# Altium schematic sheet STM32-PROX_3.SchDoc
size 225 x 183 mm
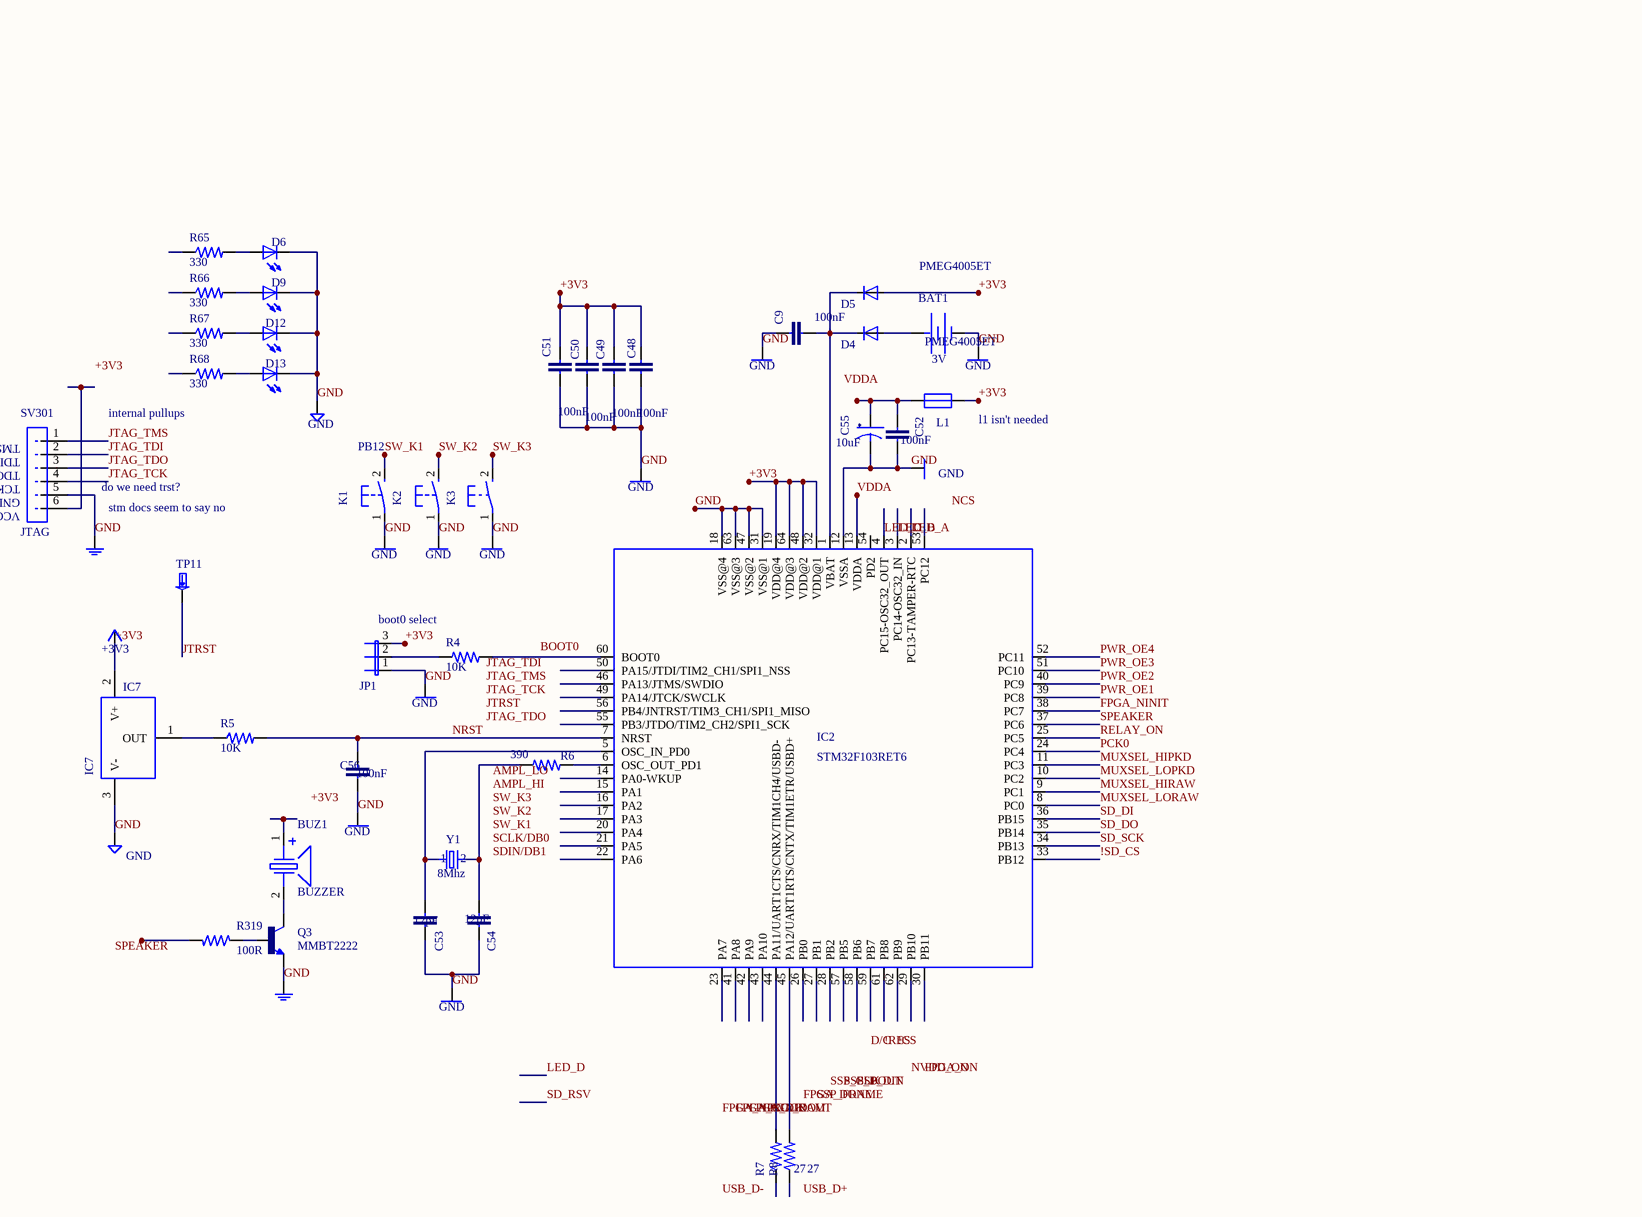
[diagram p0: STM32-PROX_3.SchDoc]

## Parts
BAT1  3V  [NSL_SPARKFUN_BATTCON_12MM]
BUZ1  BUZZER  [BUZZER]
C9  100nF  [0805]
C48  100nF  [0805]
C49  100nF  [0805]
C50  100nF  [0805]
C51  100nF  [0805]
C52  100nF  [0805]
C53  12pF  [0805]
C54  12pF  [0805]
C55  10uF  [EIA3216-KIT]
C56  100nF  [0805]
D4  PMEG4005ET  [SOT23-3]
D5  PMEG4005ET  [SOT23-3]
D6  (no value)  [LED_0603]
D9  (no value)  [LED_0603]
D12  (no value)  [LED_0603]
D13  (no value)  [LED_0603]
GND1  GND
GND2  GND
GND4  GND
GND5  GND
GND6  GND
GND7  GND
GND8  GND
GND43  GND
GND45  GND
GND46  GND
IC2  STM32F103RET6  [LQFP64_PACKAGE]
IC7  (no value)  [SOT23-3LEAD]
JP1  boot0 select  [JUMPER3]
K1  (no value)  [B3F-5XX]
K2  (no value)  [B3F-5XX]
K3  (no value)  [B3F-5XX]
L1  (no value)  [0603]
Q3  MMBT2222  [SOT-23-3]
R4  10K  [R0805]
R5  10K  [R0805]
R6  390  [R0805]
R7  27  [R0805]
R8  27  [R0805]
R65  330  [RLC_0603]
R66  330  [RLC_0603]
R67  330  [RLC_0603]
R68  330  [RLC_0603]
R319  100R  [0603]
SV301  (no value)  [HEADER-1X6]
TP11  (no value)  [KEYSTONE-PTH-TESTPOINT-5011]
U$10  +3V3
V3  (no value)
V5  (no value)
V12  GND
V40  GND
Y1  8Mhz  [CRYSTAL-TXC-7A]

## Nets
!SD_CS: IC2.33(PB12)
+3V3: C48.1 C49.1 C50.1 C51.1 D5.1(A) IC2.19(VDD@4) IC2.32(VDD@1) IC2.48(VDD@2) IC2.64(VDD@3) IC7.2(V+) JP1.3 L1.1(P$1) U$10.0(+3V3)
FPGA_NINIT: IC2.38(PC7)
GND: BAT1.GND(-) C9.1 C48.2 C49.2 C50.2 C51.2 C52.2 C53.1 C54.1 C55.C(-) C56.2 D6.-(C) D9.-(C) D12.-(C) D13.-(C) GND1.0(GND) GND2.0(GND) GND4.0(GND) GND5.0(GND) GND6.0(GND) GND7.0(GND) GND8.0(GND) GND43.0(GND) GND45.0(GND) GND46.0(GND) IC2.12(VSSA) IC2.18(VSS@4) IC2.31(VSS@1) IC2.47(VSS@2) IC2.63(VSS@3) IC7.3(V-) JP1.1 K1.1(P) K2.1(P) K3.1(P) Q3.2(E) SV301.5 V3.0(GND) V5.0(GND) V12.0(GND) V40.0(GND)
JTAG_TCK: SV301.4
JTAG_TDI: SV301.2
JTAG_TDO: SV301.3
JTAG_TMS: SV301.1
JTRST: TP11.A(P$1)
LED_A: IC2.2(PC13-TAMPER-RTC)
LED_B: IC2.3(PC14-OSC32_IN)
LED_C: IC2.4(PC15-OSC32_OUT)
MUXSEL_HIPKD: IC2.11(PC3)
MUXSEL_HIRAW: IC2.9(PC1)
MUXSEL_LOPKD: IC2.10(PC2)
MUXSEL_LORAW: IC2.8(PC0)
NRST: C56.1 IC2.7(NRST) R5.2
PCK0: IC2.24(PC4)
PWR_OE1: IC2.39(PC8)
PWR_OE2: IC2.40(PC9)
PWR_OE3: IC2.51(PC10)
PWR_OE4: IC2.52(PC11)
RELAY_ON: IC2.25(PC5)
SD_DI: IC2.36(PB15)
SD_DO: IC2.35(PB14)
SD_SCK: IC2.34(PB13)
SPEAKER: IC2.37(PC6)
SW_K1: K1.2(S)
SW_K2: K2.2(S)
SW_K3: K3.2(S)
VDDA: IC2.13(VDDA)
NetBAT1_PWR@1: BAT1.PWR@1(+) D4.1(A)
NetBUZ1_2: BUZ1.2 Q3.3(C)
NetC9_2: C9.2 D4.3(C) D5.3(C) IC2.1(VBAT)
NetC52_1: C52.1 C55.A(+) L1.2(P$2)
NetC53_2: C53.2 IC2.5(OSC_IN_PD0) Y1.P$1
NetC54_2: C54.2 R6.1 Y1.P$2
NetD6_+: D6.+(A) R65.2
NetD9_+: D9.+(A) R66.2
NetD12_+: D12.+(A) R67.2
NetD13_+: D13.+(A) R68.2
NetIC2_6: IC2.6(OSC_OUT_PD1) R6.2
NetIC2_44: IC2.44(PA11/UART1CTS/CNRX/TIM1CH4/USBD-) R7.2
NetIC2_45: IC2.45(PA12/UART1RTS/CNTX/TIM1ETR/USBD+) R8.2
NetIC2_60: IC2.60(BOOT0) R4.2
NetIC7_1: IC7.1(OUT) R5.1
NetJP1_2: JP1.2 R4.1
NetQ3_1: Q3.1(B) R319.1

Not connected (* = marked no-connect by the designer): BUZ1 1; IC2 14(PA0-WKUP) 15(PA1) 16(PA2) 17(PA3) 20(PA4) 21(PA5) 22(PA6) 23(PA7) 26(PB0) 27(PB1) 28(PB2) 29(PB10) 30(PB11) 41(PA8) 42(PA9) 43(PA10) 46(PA13/JTMS/SWDIO) 49(PA14/JTCK/SWCLK) 50(PA15/JTDI/TIM2_CH1/SPI1_NSS) 53(PC12) 54(PD2) 55(PB3/JTDO/TIM2_CH2/SPI1_SCK) 56(PB4/JNTRST/TIM3_CH1/SPI1_MISO) 57(PB5) 58(PB6) 59(PB7) 61(PB8) 62(PB9); R7 1; R8 1; R65 1; R66 1; R67 1; R68 1; R319 2; SV301 6

## Notes on the sheet
- (near R68) internal pullups
- (near K1) PB12
- (near L1) l1 isn't needed
- do we need trst?
- (near V5) stm docs seem to say no
- Labels drawn without touching a wire or pin: !CS, !RES, +3V3, AMPL_HI, AMPL_LO, BOOT0, D/C, FPGA_CCLK, FPGA_DIN, FPGA_DONE, FPGA_DOUT, FPGA_NPROGRAM, FPGA_ON, JTAG_TCK, JTAG_TDI, JTAG_TDO, JTAG_TMS, JTRST, NCS, NVDD_ON, SCLK/DB0, SDIN/DB1, SPEAKER, SSP_CLK, SSP_DIN, SSP_DOUT, SSP_FRAME, SW_K1, SW_K2, SW_K3, USB_D+, USB_D-, VDDA
- (in symbol HEADER-1X6) TMS; TDI; TDO; TCK; GND; VCC; JTAG

## Library data of the parts
BAT1 = NSL_SPARKFUN_BATTERY12MM
C9 C48-C54 C56 = CAP0805
C55 = CAP_POL1206-KIT
D4 D5 = DIODESOT23
D6 D9 D12 D13 = LED
IC2 = STM32F1_HIGH_DENSITY_LQFP64LQF64
IC7 = MCP100
JP1 = JUMPER3
K1-K3 = 5-XX
L1 = FERRITE
Q3 = TRANSISTOR_NPNSOT23
R4-R8 = R-US_R0805
R65-R68 = RESISTOR0603
R319 = R-US
SV301 = HEADER-1X6
TP11 = TESTPADKEYSTONE-PTH
V3 V5 = AGND
Y1 = CRYSTALTXC-7A